# EAGLE design capsense_coin (EAGLE 7.2.0)
Assembly variants: main
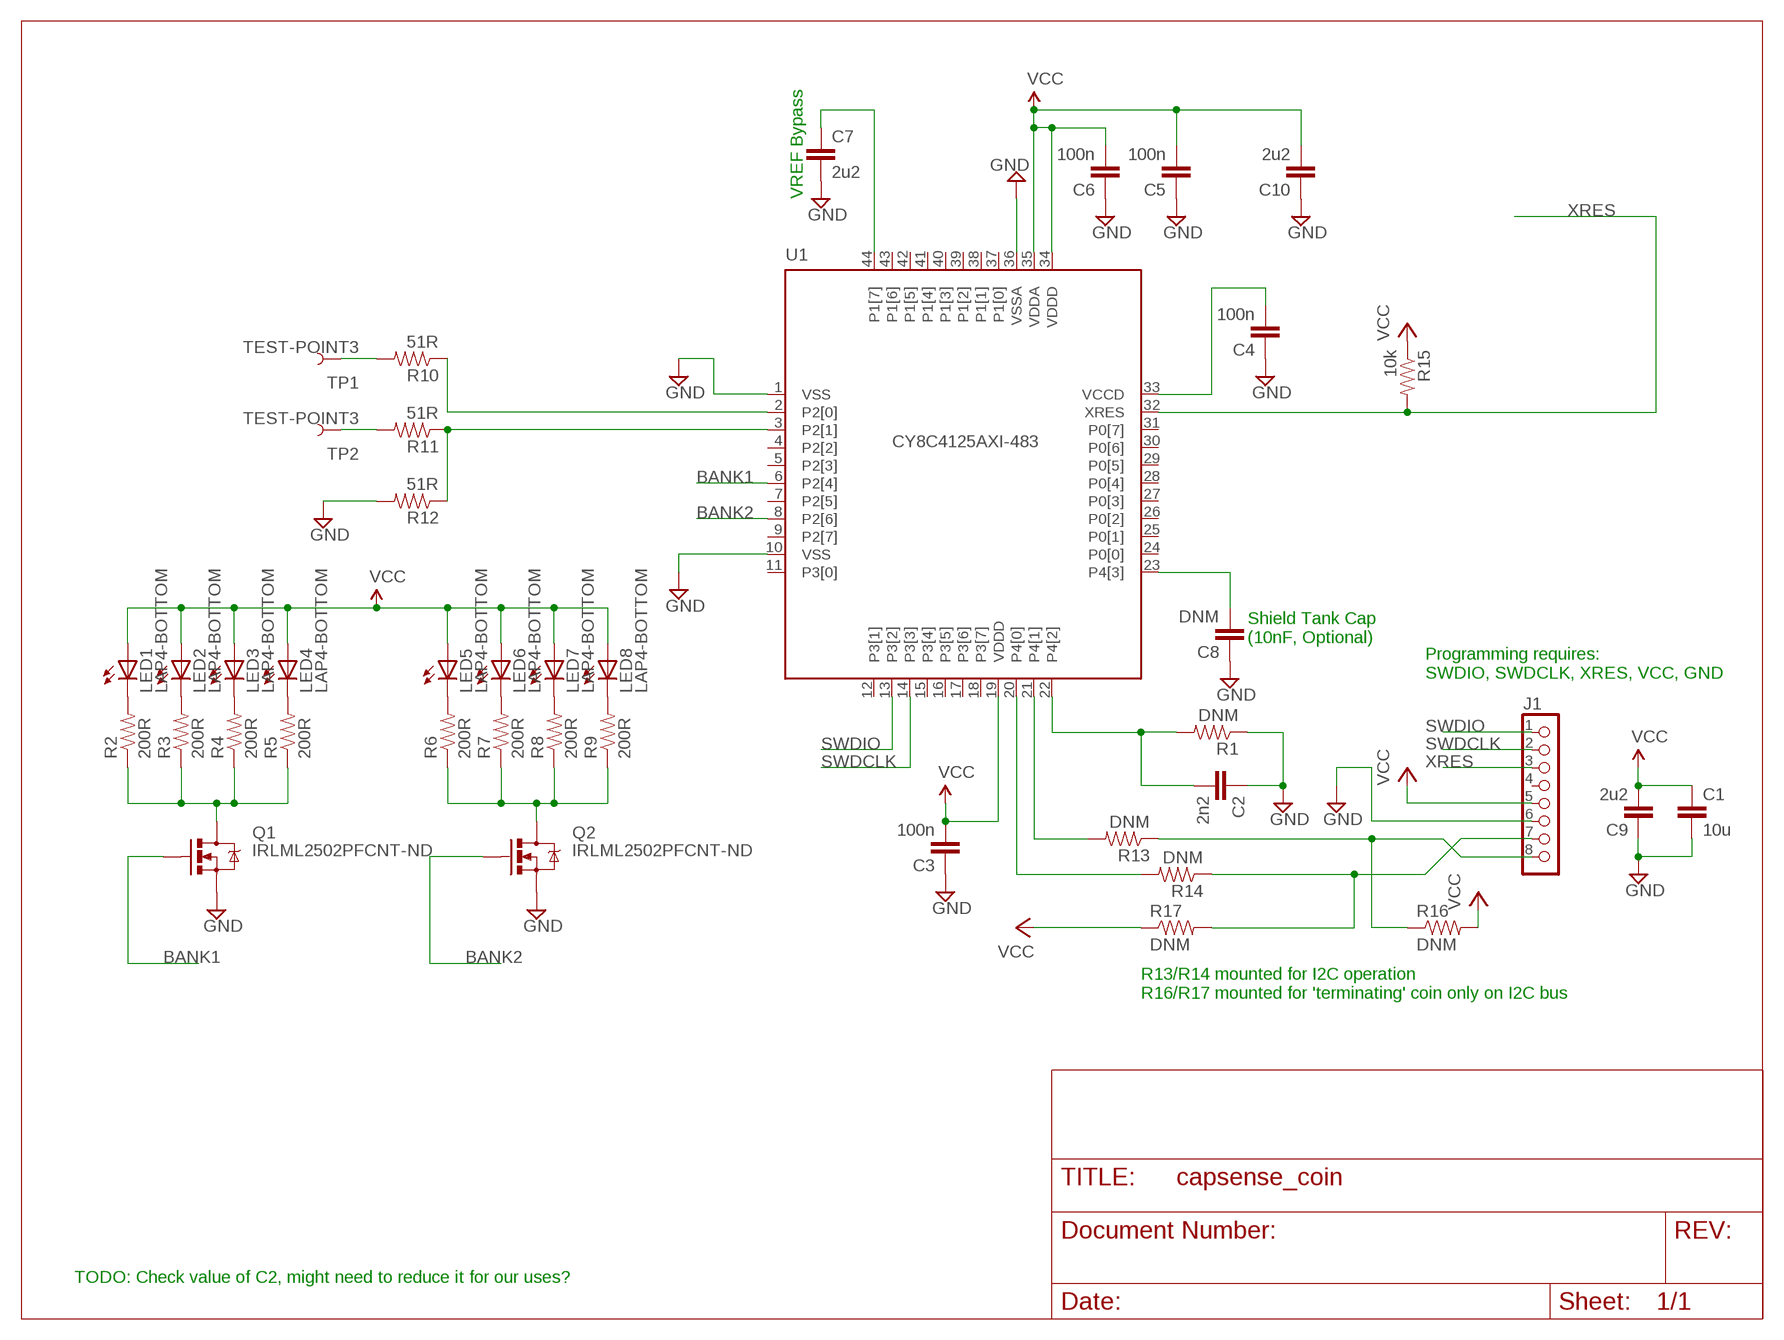
[diagram p0: schematic, sheet 1]

## Parts
C1  10u  CAP0603-CAP  [0603C]
C2  2n2  CAP0603-CAP  [0603C]
C3  100n  CAP0603-CAP  [0603C]
C4  100n  CAP0603-CAP  [0603C]
C5  100n  CAP0603-CAP  [0603C]
C6  100n  CAP0603-CAP  [0603C]
C7  2u2  CAP0603-CAP  [0603C]
C8  DNM  CAP0603-CAP  [0603C]  (not fitted in variant main)
C9  2u2  CAP0603-CAP  [0603C]
C10  2u2  CAP0603-CAP  [0603C]
J1  CON_HEADER_1X08  [DF13C-VERTSMD]
LED1  LAP4-BOTTOM  [P47F-BOTTOM]
LED2  LAP4-BOTTOM  [P47F-BOTTOM]
LED3  LAP4-BOTTOM  [P47F-BOTTOM]
LED4  LAP4-BOTTOM  [P47F-BOTTOM]
LED5  LAP4-BOTTOM  [P47F-BOTTOM]
LED6  LAP4-BOTTOM  [P47F-BOTTOM]
LED7  LAP4-BOTTOM  [P47F-BOTTOM]
LED8  LAP4-BOTTOM  [P47F-BOTTOM]
Q1  IRLML2502PFCNT-ND  MOSFET-NCHANNELBSS123LT1G  [SOT23]
Q2  IRLML2502PFCNT-ND  MOSFET-NCHANNELBSS123LT1G  [SOT23]
R1  DNM  RES0603-RES  [0603R]  (not fitted in variant main)
R2  200R  RES0603-RES  [0603R]
R3  200R  RES0603-RES  [0603R]
R4  200R  RES0603-RES  [0603R]
R5  200R  RES0603-RES  [0603R]
R6  200R  RES0603-RES  [0603R]
R7  200R  RES0603-RES  [0603R]
R8  200R  RES0603-RES  [0603R]
R9  200R  RES0603-RES  [0603R]
R10  51R  RES0603-RES  [0603R]
R11  51R  RES0603-RES  [0603R]
R12  51R  RES0603-RES  [0603R]
R13  DNM  RES0603-RES  [0603R]  (not fitted in variant main)
R14  DNM  RES0603-RES  [0603R]  (not fitted in variant main)
R15  10k  RES0603-RES  [0603R]
R16  DNM  RES0603-RES  [0603R]  (not fitted in variant main)
R17  DNM  RES0603-RES  [0603R]  (not fitted in variant main)
TP1  TEST-POINT3  [PAD.03X.03]
TP2  TEST-POINT3  [PAD.03X.03]
U1  CY8C4125AXI-483  CY8C4XXXT  [TQFP44]

## Nets
BANK1: Q1.1(G) U1.6(P2[4])
BANK2: Q2.1(G) U1.8(P2[6])
GND: C1.2 C2.1 C3.1 C4.1 C5.1 C6.1 C7.2 C8.1 C9.1 C10.1 J1.6 Q1.2(S) Q2.2(S) R1.1 R12.2 U1.1(VSS) U1.10(VSS) U1.36(VSSA)
N$1: C2.2 R1.2 U1.22(P4[2])
N$2: C7.1 U1.44(P1[7])
N$3: C4.2 U1.33(VCCD)
N$4: C8.2 U1.23(P4[3])
N$5: LED1.C R2.2
N$6: LED2.C R3.2
N$7: LED3.C R4.2
N$8: LED4.C R5.2
N$9: LED5.C R6.2
N$10: LED6.C R7.2
N$11: LED7.C R8.2
N$12: LED8.C R9.2
N$13: Q1.3(D) R2.1 R3.1 R4.1 R5.1
N$14: Q2.3(D) R6.1 R7.1 R8.1 R9.1
N$15: R10.1 U1.2(P2[0])
N$16: R11.1 R12.1 U1.3(P2[1])
N$18: R13.2 U1.21(P4[1])
N$19: R14.2 U1.20(P4[0])
N$20: J1.8 R13.1 R16.1
N$21: J1.7 R14.1 R17.2
SENSE: R10.2 TP1.P$1
SHIELD: R11.2 TP2.P$1
SWDCLK: J1.2 U1.14(P3[3])
SWDIO: J1.1 U1.13(P3[2])
VCC: C1.1 C3.2 C5.2 C6.2 C9.2 C10.2 J1.5 LED1.A LED2.A LED3.A LED4.A LED5.A LED6.A LED7.A LED8.A R15.1 R16.2 R17.1 U1.19(VDDD) U1.34(VDDD) U1.35(VDDA)
XRES: J1.3 R15.2 U1.32(XRES)
Unconnected: J1.4 U1.5(P2[3]) U1.7(P2[5]) U1.9(P2[7]) U1.11(P3[0]) U1.12(P3[1]) U1.15(P3[4]) U1.16(P3[5]) U1.18(P3[7]) U1.24(P0[0]) U1.25(P0[1]) U1.26(P0[2]) U1.27(P0[3]) U1.28(P0[4]) U1.29(P0[5]) U1.31(P0[7]) U1.37(P1[0]) U1.38(P1[1]) U1.40(P1[3]) U1.41(P1[4]) U1.42(P1[5]) U1.43(P1[6])

## Notes on the sheet
- VREF Bypass
- Shield Tank Cap
  (10nF, Optional)
- Programming requires:
  SWDIO, SWDCLK, XRES, VCC, GND
- R13/R14 mounted for I2C operation
  R16/R17 mounted for 'terminating' coin only on I2C bus
- TODO: Check value of C2, might need to reduce it for our uses?

## Power pins joined to a net without a drawn wire
P0[6]: U1.30(P0[6])
P1[2]: U1.39(P1[2])
P2[2]: U1.4(P2[2])
P3[6]: U1.17(P3[6])

## Library data of the parts
C1-C10 = custom-std:CAP: Capacitor Standard 0603 ceramic capacitor, and 0.1" leaded capacitor.
J1 = customs:CON_HEADER_1X08
LED1-LED8 = led:*P4: PointLED® Enhanced Thinfilm LED TOP & BOTTOM mount LS P47F, LR P47F, LA P47F, LY P47F, LT P4SG, LB P4SG, LW P4SG Source: http://catalog.osram-os.com .. LA_LR_LS_LY_P47F_Pb_free.pdf
Q1 Q2 = SparkFun-DiscreteSemi:MOSFET-NCHANNEL: Common NMOSFET Parts MFG P/N Store ID Prod ID FDD8780 TRANS-09984 SI7820DN TRANS-11055 FDS6630A IC-08089 2N7002PW TRANS-11151 FQP30N06L COM-10213 TRANS-10060 BSS123LT1G TRANS-08345 BSS138 TRANS-00830 BS170 2N7000; PROD_ID: TRANS-08345
R1-R17 = custom-std:RES: Resistor Basic schematic elements and footprints for 0603, 1206, and PTH resistors.
TP1 TP2 = SparkFun:TEST-POINT
U1 = customs:CY8C4XXX: PSoC® Programmable System-on-Chip TM M8C Processor Speeds up to 24 MHz Source: http://www.cypress.com .. CY8C213452.pdf; OC_FARNELL: unknown; OC_NEWARK: unknown

## Board
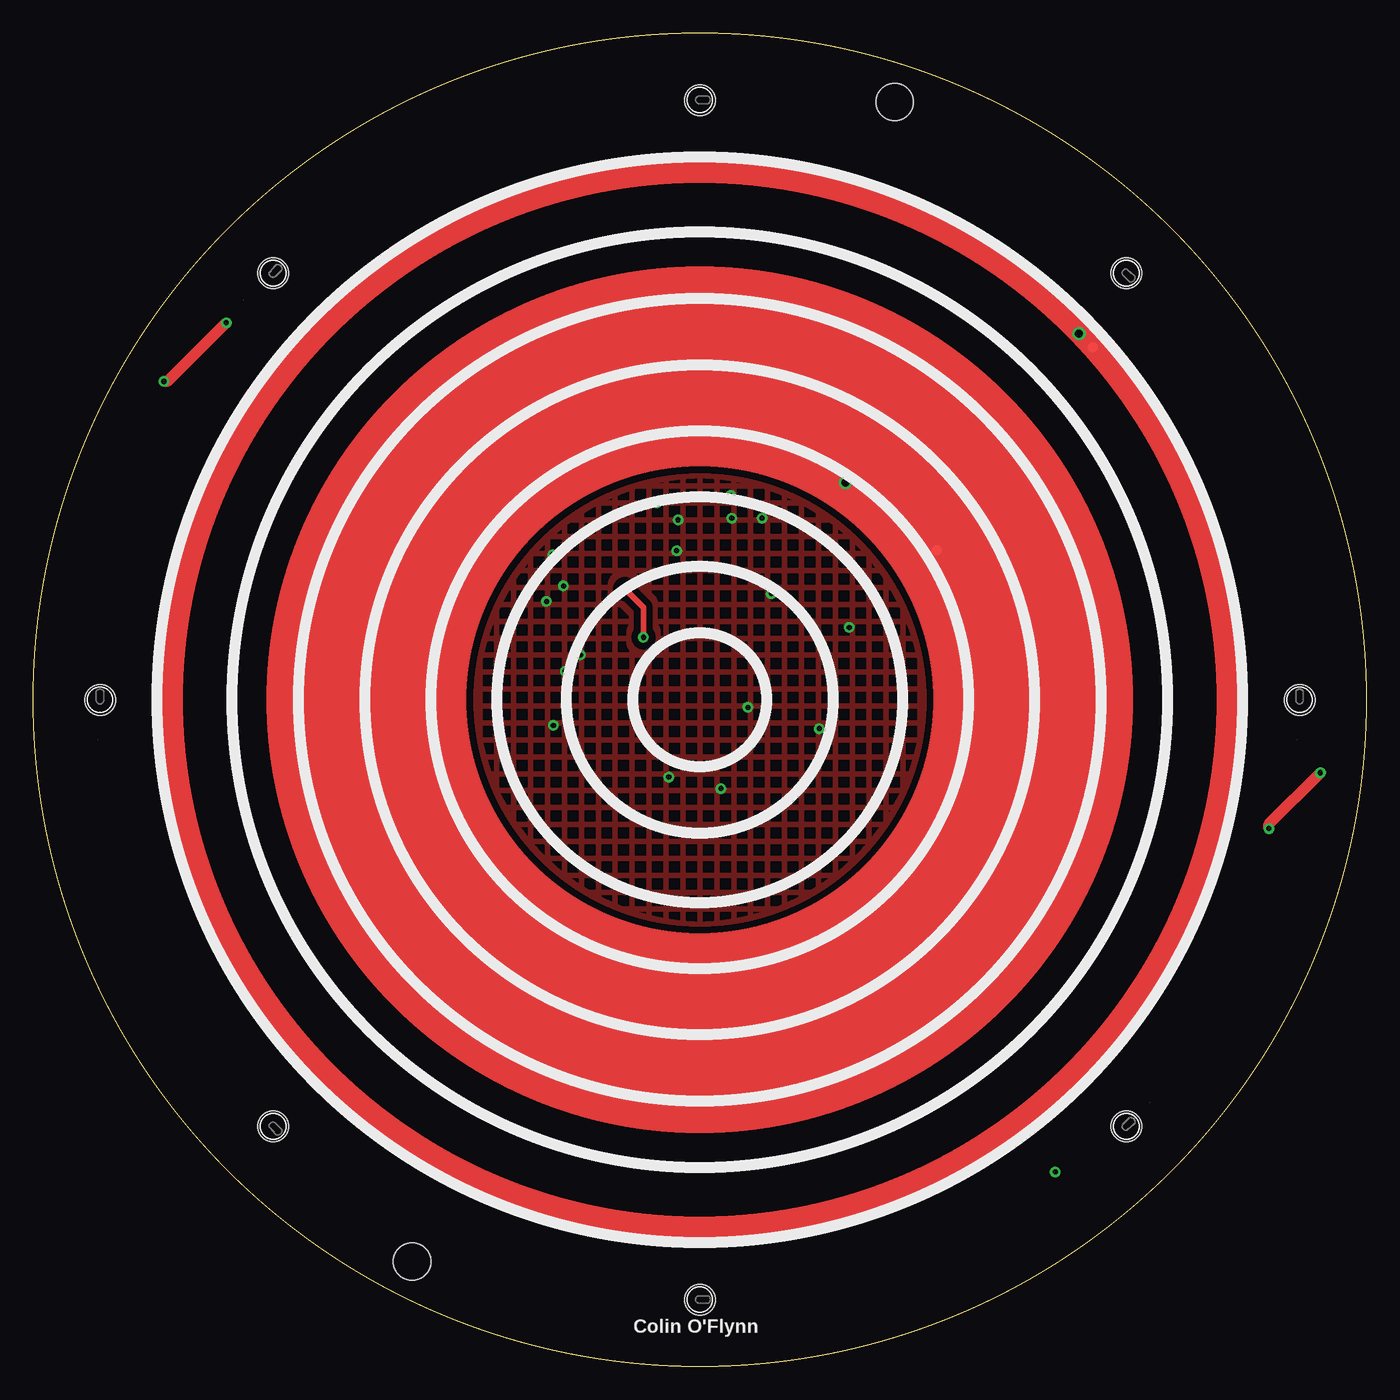
[diagram p1: board, top side]
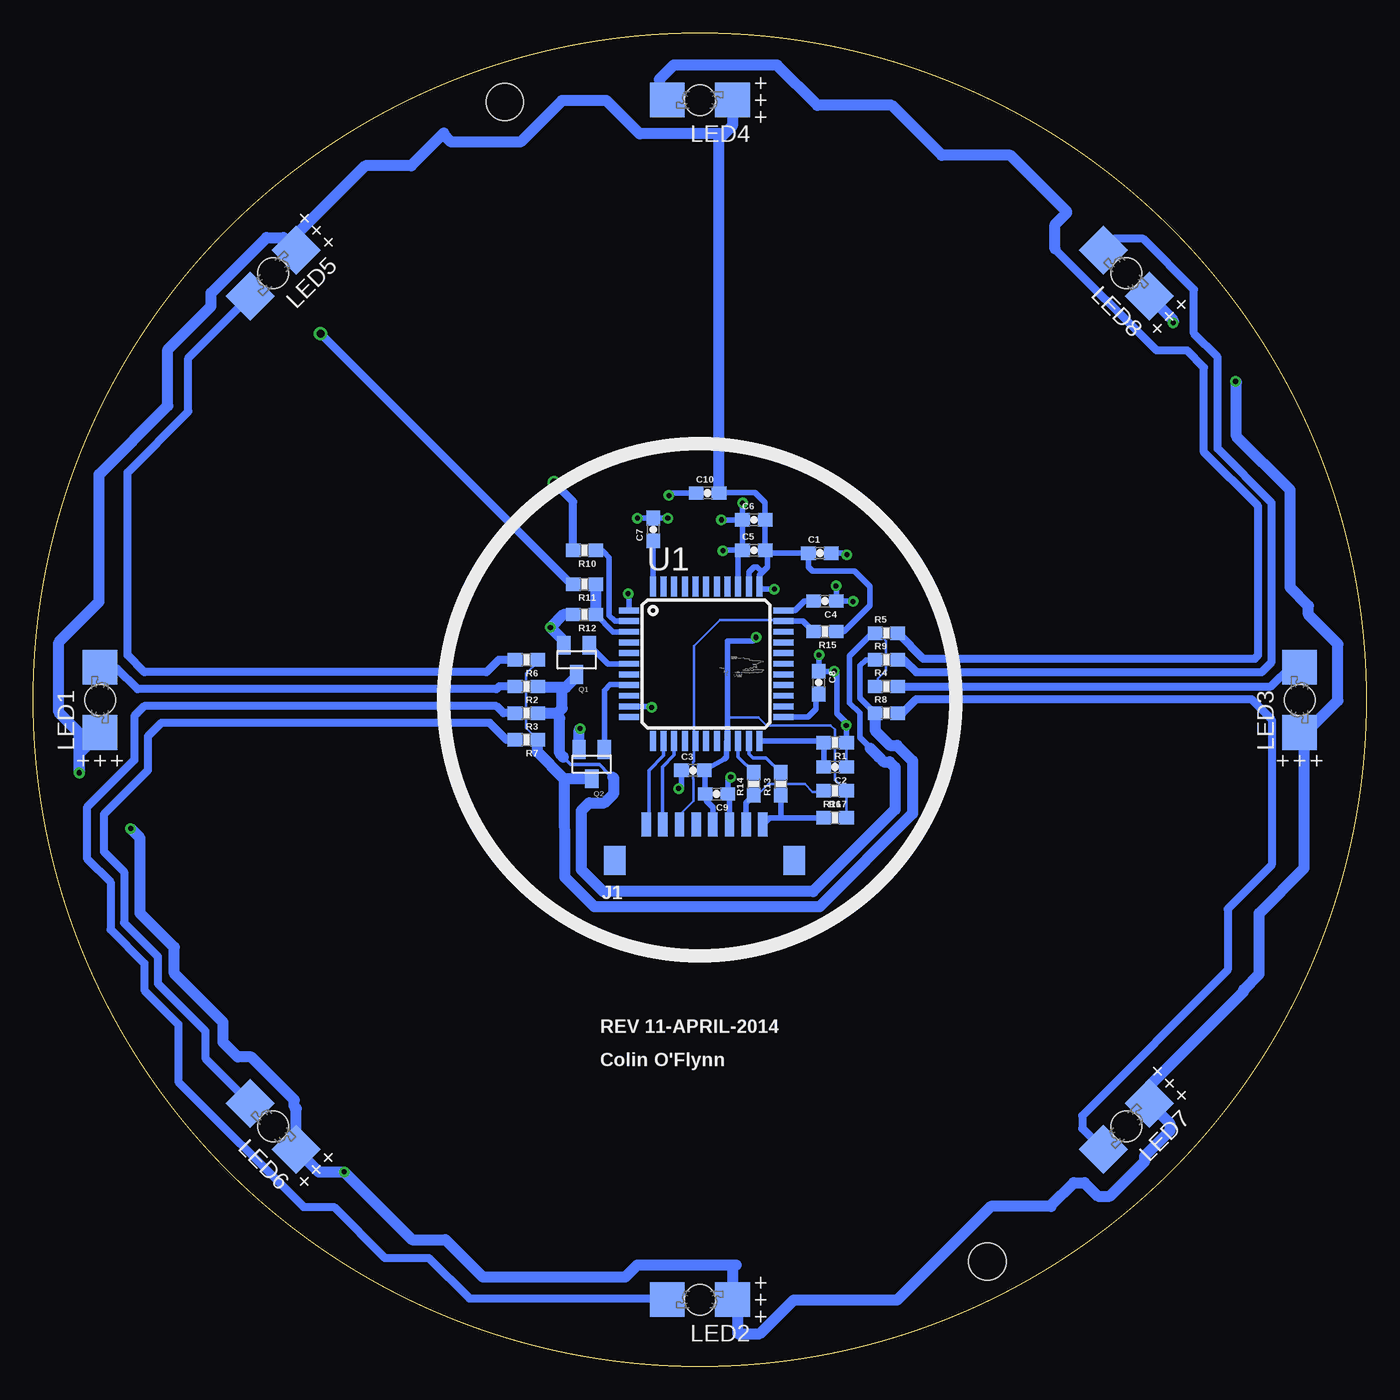
[diagram p2: board, bottom side, seen from below]

Size 100 x 100 mm. Coordinates in mm from the lower left corner, seen from the top.
Outline: circle at 50,50 radius 50
Copper layers (1*16): Top 0.035mm / dielectric 1.5mm / Bottom 0.035mm
Design rules "default *": minimum track width 7mil, minimum drill 15mil, track to track 7mil, track to pad 7mil, pad to pad 7mil, via to via 7mil, smd to smd 7mil, copper to edge 40mil, drill to drill 8mil, minimum pad ring 10mil, minimum via ring 8mil, stop-mask expansion 4mil, vias tented up to drill 20mil, thermal gap 10mil
Holes 2.8 mm at 64.61,94.84 28.42,7.85

### Footprints (pad centres in the part's own frame; a part is rotated, then mirrored left to right if it is on the bottom)
0603C = smd 1.1 x 1: 1 -0.85,0; 2 0.85,0
DF13C-VERTSMD = smd 0.7 x 1.8: 1 -3.75,0; 2 -2.5,0; 3 -1.25,0; 4 0,0; 5 1.25,0; 6 2.5,0; 7 3.75,0; 8 5,0 | smd 1.6 x 2.2: M2 7.35,-2.7; SIZE -6.1,-2.7
P47F-BOTTOM = smd 2.6 x 2.6: A -2.45,0; C 2.45,0 | hole 2.3: 0,0
SOT23 = smd 1 x 1.4: 1 -0.95,-1.1; 2 0.95,-1.1; 3 0,1.1
0603R = smd 1.1 x 1: 1 -0.85,0; 2 0.85,0
PAD.03X.03 = smd 0.762 x 0.762: P$1 0,0
TQFP44 = smd 1.5 x 0.44: 1 -5.8,4; 2 -5.8,3.2; 3 -5.8,2.4; 4 -5.8,1.6; 5 -5.8,0.8; 6 -5.8,0; 7 -5.8,-0.8; 8 -5.8,-1.6; 9 -5.8,-2.4; 10 -5.8,-3.2; 11 -5.8,-4; 23 5.8,-4; 24 5.8,-3.2; 25 5.8,-2.4; 26 5.8,-1.6; 27 5.8,-0.8; 28 5.8,0; 29 5.8,0.8; 30 5.8,1.6; 31 5.8,2.4; 32 5.8,3.2; 33 5.8,4 | smd 0.44 x 1.5: 12 -4,-5.8; 13 -3.2,-5.8; 14 -2.4,-5.8; 15 -1.6,-5.8; 16 -0.8,-5.8; 17 0,-5.8; 18 0.8,-5.8; 19 1.6,-5.8; 20 2.4,-5.8; 21 3.2,-5.8; 22 4,-5.8; 34 4,5.8; 35 3.2,5.8; 36 2.4,5.8; 37 1.6,5.8; 38 0.8,5.8; 39 0,5.8; 40 -0.8,5.8; 41 -1.6,5.8; 42 -2.4,5.8; 43 -3.2,5.8; 44 -4,5.8

### Placement (x,y rotation side)
C1  41,61 0 bottom
C2  39.85,44.96 180 bottom
C3  50.52,44.7 0 bottom
C4  40.61,57.4 180 bottom
C5  45.95,61.21 0 bottom
C6  45.95,63.5 0 bottom
C7  53.49,62.78 90 bottom
C8  41.07,51.28 270 bottom  (not fitted)
C9  48.74,42.93 180 bottom
C10  49.4,65.51 0 bottom
J1  50.26,40.64 0 bottom
LED1  95,50 90 bottom
LED2  50,5 180 bottom
LED3  5,50 90 bottom
LED4  50,95 180 bottom
LED5  82,82 225 bottom
LED6  82,18 135 bottom
LED7  18,18 225 bottom
LED8  18,82 135 bottom
Q1  59.24,53 180 bottom
Q2  58.1,45.17 180 bottom
R1  39.85,46.79 180 bottom  (not fitted)
R2  63,51 180 bottom
R3  63,49 180 bottom
R4  36,51 0 bottom
R5  36,55 0 bottom
R6  63,53 180 bottom
R7  63,47 180 bottom
R8  36,49 0 bottom
R9  36,53 0 bottom
R10  58.65,61.21 180 bottom
R11  58.65,58.67 180 bottom
R12  58.65,56.39 180 bottom
R13  43.91,43.69 90 bottom  (not fitted)
R14  45.95,43.69 90 bottom  (not fitted)
R15  40.61,55.12 180 bottom
R16  39.85,41.15 0 bottom  (not fitted)
R17  39.85,43.18 180 bottom  (not fitted)
TP1  67.79,61.21 0 top
TP2  79.47,76.45 0 top
U1  49.52,52.7 0 bottom

### Tracks (layer width: path | path; a pad name or v marks a point on that pad's centre or on a via)
BANK1
  Bottom 0.406: U1.6 56.89,52.7 Q1.1
BANK2
  Bottom 0.406: Q2.1 57.16,50.69 56.72,51.13 55.35,51.13 U1.8
GND  (via drill 0.38)
  Bottom 0.178: C2.1 R1.1
  Bottom 0.406: C3.1 51.37,43.55 v51.58,43.33 | v47.67,44.2 47.89,43.98 C9.1 47.76,42.8 J1.6 | U1.10 53.69,49.5 v53.62,49.43 | U1.1 55.32,57.91 v55.37,57.96 | U1.36 47.12,60.89 C5.1 | C5.1 C6.1 | C5.1 48.23,61.21 v48.26,61.19 | C6.1 v48.38,63.5 | v52.4,63.63 C7.2 v54.68,63.63 | C6.1 46.8,64.76 v46.78,64.77 | C1.2 39.08,61 v38.96,60.88 | v38.5,57.38 38.94,57.4 C4.1 39.76,58.53 v39.77,58.55 | v41.04,53.37 41.07,53.06 C8.1 39.91,52.13 v39.9,52.15 39.72,51.97 39.72,48.97 39.04,48.28 v39.01,48.08 39,47.82 R1.1 | C10.1 52.14,65.51 v52.32,65.33
  Bottom 0.813: Q2.2 59.06,47.75 v58.98,47.83 | Q1.2 60.19,54.4 v61.21,55.42 60.25,56.39 R12.2
  pour Top (isolate 0.508, hatched): 31.93,69.49 69.47,69.49 69.47,29.9 31.44,29.9 31.44,69.75
N$1
  Bottom 0.406: U1.22 40.81,46.9 R1.2 C2.2
N$2
  Bottom 0.406: U1.44 53.52,61.9 C7.1
N$3
  Bottom 0.406: U1.33 42.84,56.7 42.14,57.4 C4.2
N$4
  Bottom 0.406: U1.23 41.87,48.7 41.27,49.3 41.27,50.23 C8.2
N$5
  Bottom 0.61: R2.2 65.05,51 65.25,50.8 92.17,50.8 93.7,52.32 94.87,52.32 LED1.C
N$6
  Bottom 0.61: LED2.C 52.53,5.08 67.28,5.08 70.33,8.13 73.63,8.13 77.44,11.94 79.73,11.94 89.13,21.34 89.13,25.65 91.67,28.19 91.67,30.23 94.21,32.77 94.21,36.32 95.98,38.1 95.98,41.91 92.43,45.47 92.43,48.77 92.2,49 91.67,49.53 65.25,49.53 64.72,49 R3.2
N$7
  Bottom 0.61: R4.2 7.14,51 5.56,52.58 5.13,52.58 LED3.C
N$8
  Bottom 0.61: R5.2 33.25,53.09 8.35,53.09 8.1,53.34 8.1,64.52 12.16,68.58 12.16,74.93 13.43,76.2 15.72,76.2 23.34,83.82 | 52.55,95.1 LED4.C
  Bottom 0.813: 23.34,83.82 23.34,85.65 22.48,86.51 22.48,86.64 26.69,90.86 31.85,90.86 35.58,94.59 41.17,94.59 44.19,97.61 51.97,97.61 53.03,96.55 53.03,95.58 LED4.C
N$9
  Bottom 0.61: R6.2 65.08,53 66.01,52.07 91.67,52.07 92.94,53.34 92.94,67.06 88.36,71.63 88.36,75.64 LED5.C
N$10
  Bottom 0.61: R7.2 64.5,47 65.76,48.26 90.4,48.26 91.41,47.24 91.41,44.7 94.71,41.4 94.71,38.61 93.19,37.08 93.19,33.27 90.65,30.73 90.65,28.7 87.09,25.15 87.09,23.09 LED6.C
N$11
  Bottom 0.61: R8.2 34.79,49 33.75,50.04 8.61,50.04 7.08,48.51 7.08,37.59 10.39,34.29 10.39,29.72 21.31,18.8 21.31,17.84 LED7.C
N$12
  Bottom 0.61: R9.2 34.68,53 33.75,52.07 7.85,52.07 7.08,52.83 7.08,64.77 11.15,68.83 11.15,75.69 12.93,77.47 12.93,80.77 16.74,84.58 18.88,84.58 LED8.C
N$13
  Bottom 0.203: R5.1 36.61,55 36.02,54.41 36.02,52.2 36.62,51.59 36.62,51.23 R4.1
  Bottom 0.254: 60.22,45.67 59.69,45.14 57.53,45.14 56.84,44.45 56.54,44.2
  Bottom 0.406: R5.1 37.05,55 38.76,53.29 38.76,49.76 38,49 38,47.17 37.21,46.38
  Bottom 0.813: Q1.3 59.24,51.73 60.07,50.9 60.35,50.9 | 60.35,50.9 62.05,50.9 R2.1 | R3.1 60.67,49 | 60.67,49 60.32,49.35 60.32,50.88 60.35,50.9 | 37.21,46.38 37.21,46.35 36.57,45.72 36.57,45.7 36.22,45.34 35.76,45.34 35.35,44.93 35.35,41.76 41.5,35.61 57.25,35.61 58.88,37.24 58.88,41.68 58.29,42.27 57.15,42.27 56.44,42.98 56.44,44.09 56.54,44.2 | 60.67,49 60.5,48.62 60.5,45.97 60.3,45.77 60.22,45.67
N$14
  Bottom 0.203: R6.1 62.15,52.83 63.02,51.97 63.02,47.87 R7.1
  Bottom 0.406: R9.1 37.55,53 37.97,52.58 37.97,50.12 R8.1
  Bottom 0.813: Q2.3 60.17,44.07 | 60.17,44.07 62.18,46.08 62.18,46.97 R7.1 | R8.1 36.85,47.7 35.73,46.58 35.2,46.58 34.03,45.41 34.03,41.45 41.02,34.47 57.91,34.47 60.12,36.68 60.14,44.02 | 60.14,44.02 60.14,44.12 | 60.17,44.07 60.17,44.05 60.14,44.02
N$15
  Bottom 0.406: U1.2 56.36,55.9 56.79,56.34 56.79,60.68 57.27,61.16 57.75,61.16 R10.1
N$16
  Bottom 0.406: U1.3 56.51,55.1 R12.1
  Bottom 0.813: R12.1 R11.1
N$18
  Bottom 0.254: U1.21 46.32,45.94 46.02,45.64 45.02,45.64 R13.2
N$19
  Bottom 0.254: U1.20 47.12,45.71 R14.2
N$20
  Bottom 0.406: R16.1 43.97,41.15 | 43.97,41.15 44.76,41.15 J1.8 | R13.1 43.91,41.2 43.97,41.15
N$21
  Bottom 0.178: R14.1 45.65,42.84 44.83,43.66 42.11,43.66 41.53,43.08 40.8,43.08 R17.2
  Bottom 0.406: J1.7 46.51,42.27 R14.1
SENSE  (via drill 0.6)
  Top 0.61: v60.93,66.29 62.71,66.29 TP1.P$1
  Bottom 0.61: R10.2 59.5,64.86 v60.93,66.29
SHIELD  (via drill 0.6)
  Top 0.61: v78.46,77.47 TP2.P$1
  Bottom 0.61: R11.2 59.66,58.67 v78.46,77.47
SWDCLK
  Bottom 0.254: U1.14 51.92,45.84 52.8,44.96 52.8,40.68 J1.2
SWDIO
  Bottom 0.254: U1.13 52.72,45.8 53.82,44.7 53.82,40.83 J1.1
VCC  (via drill 0.38)
  Top 0.406: v45.77,54.69 45.77,56.92 v44.4,58.29
  Top 0.813: v9.8,73.89 10.08,73.89 v14.48,78.28 | v92.71,40.34 92.71,40.66 v96.54,44.5 v96.57,44.53
  Bottom 0.178: R16.2 R17.1 39.81,43.99 39.85,43.99 39.85,47.78 40.18,48.06 44.98,48.06 45.59,48.67 47.92,48.67
  Bottom 0.406: 45.31,59.56 45.52,59.35 U1.34 45.31,58.29 v44.4,58.29 | 45.31,59.56 44.93,59.94 44.93,61.05 C5.2 | C5.2 44.88,61 C1.1 41.86,59.97 41.55,59.66 38.4,59.66 37.23,58.5 37.23,57.07 39.19,55.12 R15.1 | U1.35 46.32,59.57 45.95,59.94 45.69,59.94 45.31,59.56 | J1.5 49.01,41.93 49.5,42.42 49.5,42.84 C9.2 49.59,44.63 C3.2 48.14,45.55 47.98,45.72 47.98,46.84 U1.19 47.92,48.67 47.92,54.41 46.04,54.41 v45.77,54.69 | C5.2 C6.2 45.1,64.78 45.87,65.56 48.5,65.56 C10.2
  Bottom 0.813: LED8.A 14.48,78.47 v14.48,78.28 | 47.24,94.69 LED4.A 47.55,93.06 48.16,92.46 | LED1.A 96.57,45.98 v96.57,44.53 | v9.8,73.89 9.73,73.81 9.73,69.75 5.71,65.73 5.71,58.42 4.34,57.05 4.34,56.39 2.13,54.18 2.13,49.94 4.52,47.55 LED3.A 4.47,47.02 4.65,46.84 4.65,37.36 8.02,33.98 8.02,29.41 9.19,28.25 9.19,28.12 16.27,21.04 LED7.A 14.7,18.17 14.7,17.68 16.61,15.77 16.61,15.37 19.23,12.75 20.11,12.75 21.13,13.77 21.94,13.77 23.62,12.09 23.62,11.99 28.17,11.99 35.18,4.98 42.95,4.98 45.49,2.44 47.17,2.44 47.17,4.62 LED2.A 47.55,7.31 47.27,7.59 54.68,7.59 55.57,6.71 66.29,6.71 69.08,9.5 71.6,9.5 v76.68,14.58 78.58,14.58 LED6.A 80.27,19.31 80.41,19.46 80.41,19.96 83.64,23.19 84.66,23.19 85.77,24.31 85.77,25.81 89.43,29.46 89.43,31.42 92,33.98 92,39.62 v92.71,40.34 | v96.54,44.5 96.54,47.5 98.09,49.05 98.09,54.33 95.07,57.35 95.07,66.9 89.91,72.06 89.91,76.28 86.66,79.53 86.66,80.52 82.5,84.68 81.22,84.68 80.85,84.32 | 80.85,84.32 LED5.A | 48.16,92.46 54.51,92.46 57,94.94 60.35,94.94 63.45,91.85 68.65,91.85 69.26,92.46 | 69.21,92.51 69.26,92.46 | 69.26,92.46 71.65,90.07 75.11,90.07 80.85,84.32 | C10.2 48.55,92.06 48.16,92.46
XRES
  Bottom 0.178: J1.3 51.51,41.35 50.47,42.39 50.47,44.07 50.49,44.09 50.49,45.31 50.44,45.36 50.44,54.03 48.49,55.98 43.8,55.98 U1.32
  Bottom 0.406: U1.32 42.24,55.9 R15.2
(copper drawn outside any net)
  shapes: Top circle x2

### Text on the board
tPlace: Colin O'Flynn
bPlace: REV 11-APRIL-2014 | Colin O'Flynn